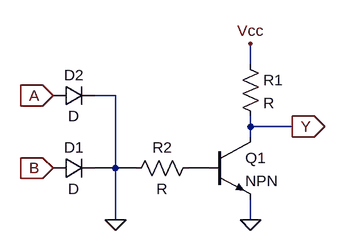
[diagram p0: schematic NOR.asc]
NOR.asc, the LTspice schematic file:
Version 4
SHEET 1 880 680
WIRE 272 16 272 -16
WIRE 64 64 32 64
WIRE 272 112 272 96
WIRE 336 112 272 112
WIRE 272 128 272 112
WIRE 64 176 64 64
WIRE 64 176 32 176
WIRE 96 176 64 176
WIRE 208 176 176 176
WIRE 64 256 64 176
WIRE 272 256 272 224
FLAG -32 64 A
IOPIN -32 64 In
FLAG -32 176 B
IOPIN -32 176 In
FLAG 272 256 0
FLAG 64 256 0
FLAG 272 -16 Vcc
FLAG 336 112 Y
IOPIN 336 112 Out
SYMBOL npn 208 128 R0
SYMATTR InstName Q1
SYMBOL res 256 0 R0
SYMATTR InstName R1
SYMBOL res 192 160 R90
WINDOW 0 0 56 VBottom 2
WINDOW 3 32 56 VTop 2
SYMATTR InstName R2
SYMBOL diode -32 192 R270
WINDOW 0 32 32 VTop 2
WINDOW 3 0 32 VBottom 2
SYMATTR InstName D1
SYMBOL diode -32 80 R270
WINDOW 0 32 32 VTop 2
WINDOW 3 0 32 VBottom 2
SYMATTR InstName D2

The netlist it stands for:
* NOR.asc
Q1 Y N001 0 0 NPN
R1 Vcc Y R
R2 N001 0 R
D1 B 0 D
D2 A 0 D
.model D D
.lib standard.dio
.model NPN NPN
.model PNP PNP
.lib standard.bjt
.backanno
.end